# Altium schematic sheet TX_GROUP.SchDoc
size A; SheetNumber: 4; SheetTotal: 7
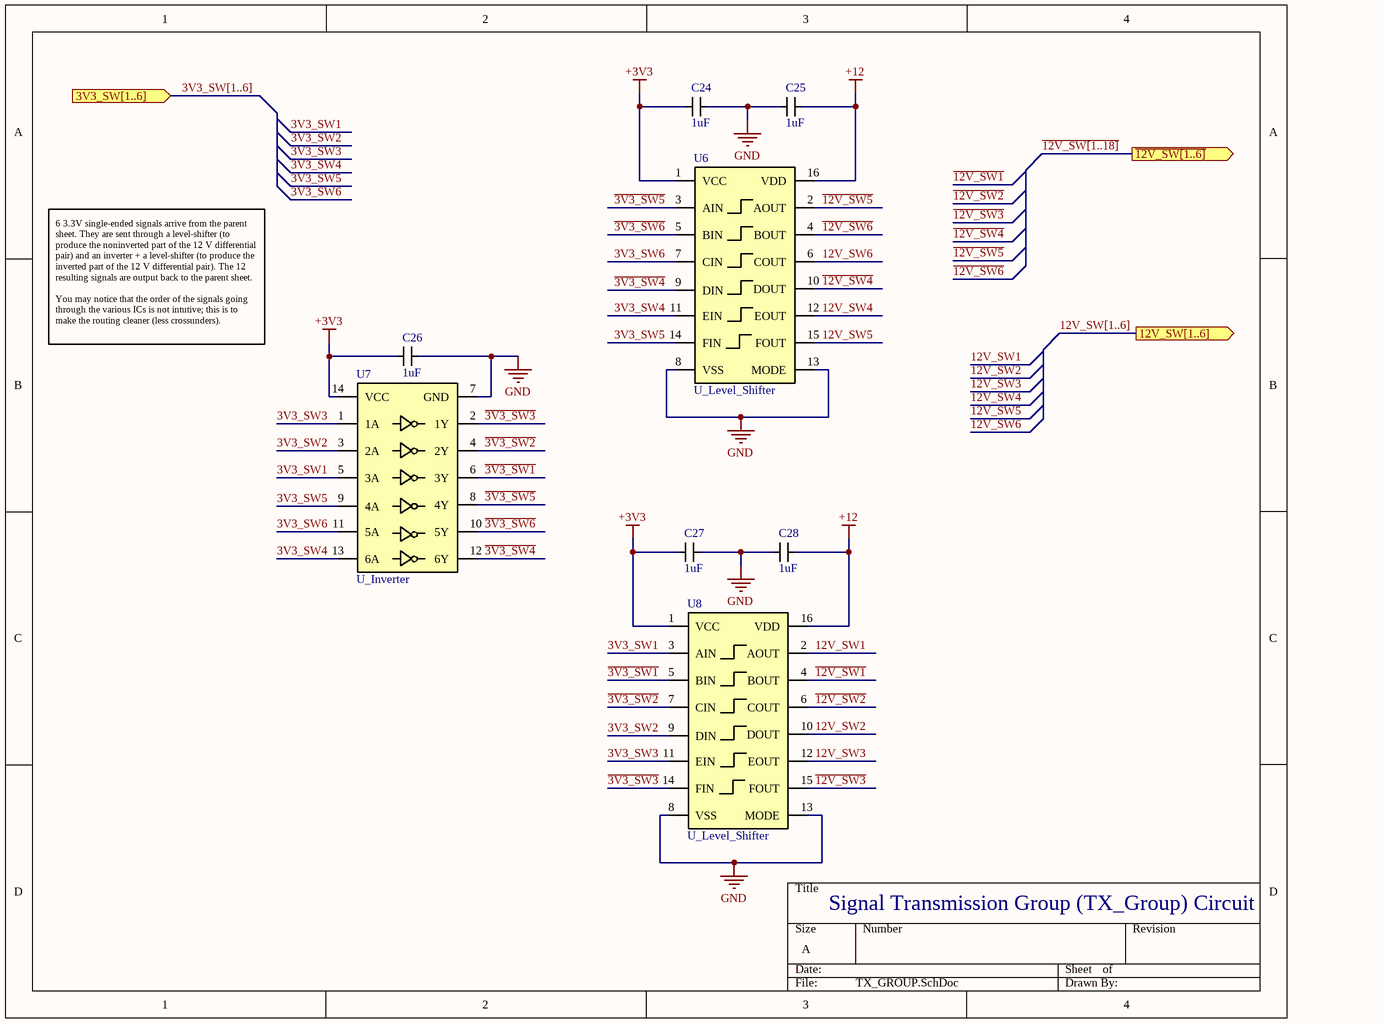
[diagram p0: TX_GROUP.SchDoc]

## Parts
C24  1uF  [0603_CAP]
C25  1uF  [0603_CAP]
C26  1uF  [0603_CAP]
C27  1uF  [0603_CAP]
C28  1uF  [0603_CAP]
U6  U_Level_Shifter  [TSSOP-16]
U7  U_Inverter  [INVERTER]
U8  U_Level_Shifter  [TSSOP-16]

## Ports
3V3_SW[1..6] (in, see TX[2A], TX[1B]), 12V_SW[1..6] (out, see TX[3A], Jacks[1A], TX[4A]), ~{12V_SW[1..6]} (out, see TX[3A], Jacks[1C], TX[4B])

## Nets
+3V3: C24.1 C26.1 C27.1 U6.1(VCC) U7.14(VCC) U8.1(VCC)
+12: C25.2 C28.2 U6.16(VDD) U8.16(VDD)
GND: C24.2 C25.1 C26.2 C27.2 C28.1 U6.8(VSS) U6.13(MODE) U7.7(GND) U8.8(VSS) U8.13(MODE)
3V3_SW1: U7.5(3A) U8.3(AIN)
3V3_SW2: U7.3(2A) U8.9(DIN)
3V3_SW3: U7.1(1A) U8.11(EIN)
3V3_SW4: U6.11(EIN) U7.13(6A)
3V3_SW5: U6.14(FIN) U7.9(4A)
3V3_SW6: U6.7(CIN) U7.11(5A)
12V_SW1: U8.2(AOUT)
12V_SW2: U8.10(DOUT)
12V_SW3: U8.12(EOUT)
12V_SW4: U6.12(EOUT)
12V_SW5: U6.15(FOUT)
12V_SW6: U6.6(COUT)
~{3V3_SW1}: U7.6(3Y) U8.5(BIN)
~{3V3_SW2}: U7.4(2Y) U8.7(CIN)
~{3V3_SW3}: U7.2(1Y) U8.14(FIN)
~{3V3_SW4}: U6.9(DIN) U7.12(6Y)
~{3V3_SW5}: U6.3(AIN) U7.8(4Y)
~{3V3_SW6}: U6.5(BIN) U7.10(5Y)
~{12V_SW1}: U8.4(BOUT)
~{12V_SW2}: U8.6(COUT)
~{12V_SW3}: U8.15(FOUT)
~{12V_SW4}: U6.10(DOUT)
~{12V_SW5}: U6.2(AOUT)
~{12V_SW6}: U6.4(BOUT)

## Buses and harness runs
bus 3V3_SW[1..6] = port 3V3_SW[1..6]
bus 12V_SW[1..6] = port 12V_SW[1..6]
bus ~{12V_SW[1..18]} = port ~{12V_SW[1..6]}

## Notes on the sheet
- 6 3.3V single-ended signals arrive from the parent sheet. They are sent through a level-shifter (to produce the noninverted part of the 12 V differential pair) and an inverter + a level-shifter (to produce the inverted part of the 12 V differential pair). The 12 resulting signals are output back to the parent sheet.
  You may notice that the order of the signals going through the various ICs is not intutive; this is to make the routing cleaner (less crossunders).
- Signal Transmission Group (TX_Group) Circuit

## Library data of the parts
C24-C28 = C_1uF_0603: Capacitor SMD MLCC 1 uF 0603 25 V
U6 U8 = U_Level_Shifter: IC 6-in-1 level shifter
U7 = U_Inverter: IC 6-in-1 inverter